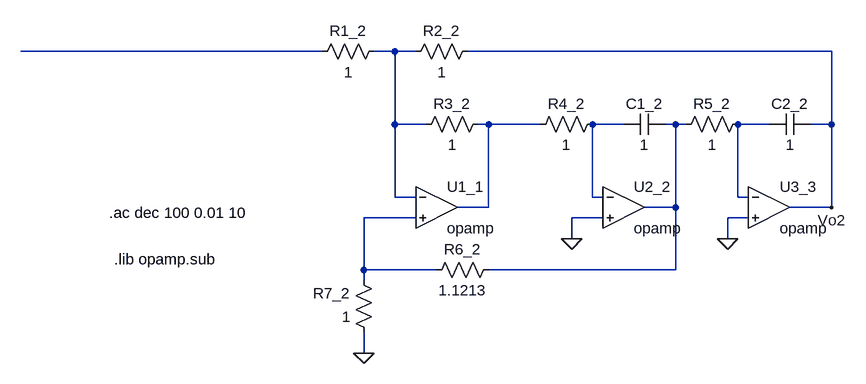
[diagram p0: schematic Tarea_2_KHN.asc]
Tarea_2_KHN.asc, the LTspice schematic file:
Version 4
SHEET 1 2680 680
WIRE 880 160 416 160
WIRE 992 160 960 160
WIRE 1024 160 992 160
WIRE 1664 160 1104 160
WIRE 992 272 992 160
WIRE 1040 272 992 272
WIRE 1136 272 1120 272
WIRE 1216 272 1136 272
WIRE 1344 272 1296 272
WIRE 1424 272 1408 272
WIRE 1440 272 1424 272
WIRE 1568 272 1520 272
WIRE 1664 272 1664 160
WIRE 1664 272 1632 272
WIRE 992 384 992 272
WIRE 1024 384 992 384
WIRE 1296 384 1296 272
WIRE 1312 384 1296 384
WIRE 1520 384 1520 272
WIRE 1536 384 1520 384
WIRE 1136 400 1136 272
WIRE 1136 400 1088 400
WIRE 1424 400 1424 272
WIRE 1424 400 1376 400
WIRE 1664 400 1664 272
WIRE 1664 400 1600 400
WIRE 1024 416 944 416
WIRE 1312 416 1264 416
WIRE 1536 416 1504 416
WIRE 1264 448 1264 416
WIRE 1504 448 1504 416
WIRE 944 496 944 416
WIRE 1056 496 944 496
WIRE 1424 496 1424 400
WIRE 1424 496 1136 496
WIRE 944 512 944 496
WIRE 944 624 944 592
FLAG 944 624 0
FLAG 1264 448 0
FLAG 1504 448 0
FLAG 1664 400 Vo2
SYMBOL res 976 144 R90
WINDOW 0 0 56 VBottom 2
WINDOW 3 32 56 VTop 2
SYMATTR InstName R1_2
SYMATTR Value 1
SYMBOL res 1120 144 R90
WINDOW 0 0 56 VBottom 2
WINDOW 3 32 56 VTop 2
SYMATTR InstName R2_2
SYMATTR Value 1
SYMBOL res 1136 256 R90
WINDOW 0 0 56 VBottom 2
WINDOW 3 32 56 VTop 2
SYMATTR InstName R3_2
SYMATTR Value 1
SYMBOL res 1312 256 R90
WINDOW 0 0 56 VBottom 2
WINDOW 3 32 56 VTop 2
SYMATTR InstName R4_2
SYMATTR Value 1
SYMBOL res 1536 256 R90
WINDOW 0 0 56 VBottom 2
WINDOW 3 32 56 VTop 2
SYMATTR InstName R5_2
SYMATTR Value 1
SYMBOL res 960 608 R180
WINDOW 0 36 76 Left 2
WINDOW 3 36 40 Left 2
SYMATTR InstName R7_2
SYMATTR Value 1
SYMBOL res 1040 512 R270
WINDOW 0 32 56 VTop 2
WINDOW 3 0 56 VBottom 2
SYMATTR InstName R6_2
SYMATTR Value 1.1213
SYMBOL cap 1408 256 R90
WINDOW 0 0 32 VBottom 2
WINDOW 3 32 32 VTop 2
SYMATTR InstName C1_2
SYMATTR Value 1
SYMBOL OpAmps\\opamp 1056 336 R0
SYMATTR InstName U1_1
SYMBOL OpAmps\\opamp 1344 336 R0
SYMATTR InstName U2_2
SYMBOL OpAmps\\opamp 1568 336 R0
SYMATTR InstName U3_3
SYMBOL cap 1632 256 R90
WINDOW 0 0 32 VBottom 2
WINDOW 3 32 32 VTop 2
SYMATTR InstName C2_2
SYMATTR Value 1
TEXT 552 408 Left 2 !.ac dec 100 0.01 10
TEXT 560 480 Left 2 !.lib opamp.sub

The netlist it stands for:
* Tarea_2_KHN.asc
R1_2 N002 N001 1
R2_2 Vo2 N002 1
R3_2 N003 N002 1
R4_2 N004 N003 1
R5_2 N006 N005 1
R7_2 0 N007 1
R6_2 N007 N005 1.1213
C1_2 N005 N004 1
XU1_1 N002 N007 N003 opamp Aol=100K GBW=10Meg  ; pins invin noninvin out
XU2_2 N004 0 N005 opamp Aol=100K GBW=10Meg  ; pins invin noninvin out
XU3_3 N006 0 Vo2 opamp Aol=100K GBW=10Meg  ; pins invin noninvin out
C2_2 Vo2 N006 1
.ac dec 100 0.01 10
.lib opamp.sub
.backanno
.end